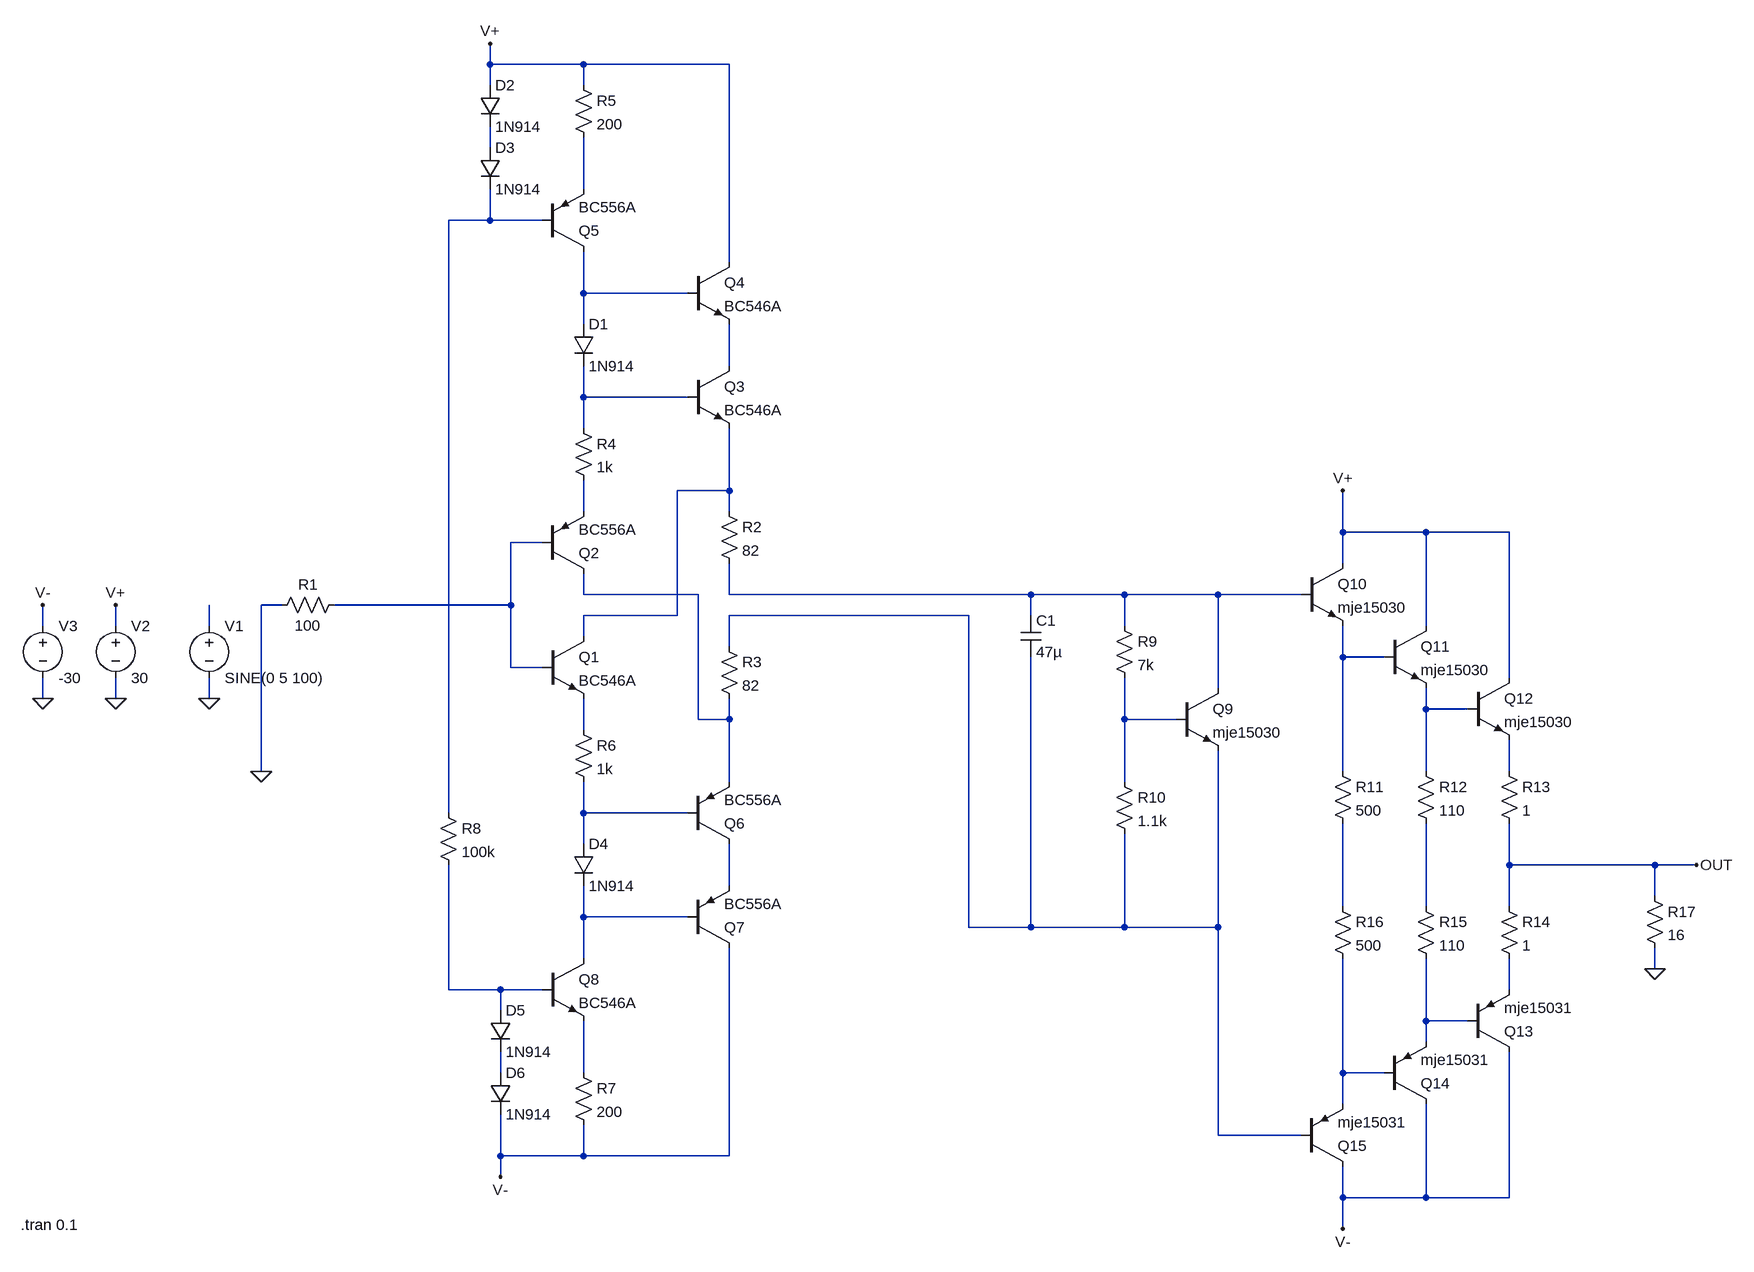
[diagram p0: schematic CFA3.asc]
CFA3.asc, the LTspice schematic file:
Version 4
SHEET 1 2036 1176
WIRE 112 -720 112 -752
WIRE 256 -720 112 -720
WIRE 480 -720 256 -720
WIRE 112 -688 112 -720
WIRE 256 -688 256 -720
WIRE 112 -592 112 -624
WIRE 256 -528 256 -608
WIRE 112 -480 112 -528
WIRE 112 -480 48 -480
WIRE 192 -480 112 -480
WIRE 480 -416 480 -720
WIRE 256 -368 256 -432
WIRE 416 -368 256 -368
WIRE 256 -320 256 -368
WIRE 480 -256 480 -320
WIRE 256 -208 256 -256
WIRE 416 -208 256 -208
WIRE 256 -160 256 -208
WIRE 480 -64 480 -160
WIRE 480 -64 400 -64
WIRE 256 -32 256 -80
WIRE 480 -32 480 -64
WIRE 1424 0 1424 -64
WIRE 1552 0 1424 0
WIRE 1680 0 1552 0
WIRE 192 16 144 16
WIRE 1424 48 1424 0
WIRE 256 96 256 64
WIRE 432 96 256 96
WIRE 480 96 480 48
WIRE 944 96 480 96
WIRE 1088 96 944 96
WIRE 1232 96 1088 96
WIRE 1360 96 1232 96
WIRE -208 112 -240 112
WIRE 144 112 144 16
WIRE 144 112 -128 112
WIRE 400 128 400 -64
WIRE 400 128 256 128
WIRE 848 128 480 128
WIRE 944 128 944 96
WIRE -576 144 -576 112
WIRE -464 144 -464 112
WIRE -320 144 -320 112
WIRE 1088 144 1088 96
WIRE 1552 144 1552 0
WIRE 256 160 256 128
WIRE 480 176 480 128
WIRE 1424 192 1424 144
WIRE 1488 192 1424 192
WIRE 144 208 144 112
WIRE 192 208 144 208
WIRE 1680 224 1680 0
WIRE 1232 240 1232 96
WIRE -576 256 -576 224
WIRE -464 256 -464 224
WIRE -320 256 -320 224
WIRE 1552 272 1552 240
WIRE 1616 272 1552 272
WIRE 432 288 432 96
WIRE 480 288 480 256
WIRE 480 288 432 288
WIRE 1088 288 1088 224
WIRE 1168 288 1088 288
WIRE 256 304 256 256
WIRE -240 368 -240 112
WIRE 1424 368 1424 192
WIRE 1552 368 1552 272
WIRE 1680 368 1680 320
WIRE 480 384 480 288
WIRE 1088 384 1088 288
WIRE 48 432 48 -480
WIRE 256 432 256 384
WIRE 416 432 256 432
WIRE 256 480 256 432
WIRE 1680 512 1680 448
WIRE 1904 512 1680 512
WIRE 1968 512 1904 512
WIRE 480 544 480 480
WIRE 1904 560 1904 512
WIRE 1424 576 1424 448
WIRE 1552 576 1552 448
WIRE 1680 576 1680 512
WIRE 256 592 256 544
WIRE 416 592 256 592
WIRE 848 608 848 128
WIRE 944 608 944 192
WIRE 944 608 848 608
WIRE 1088 608 1088 464
WIRE 1088 608 944 608
WIRE 1232 608 1232 336
WIRE 1232 608 1088 608
WIRE 256 656 256 592
WIRE 1904 672 1904 640
WIRE 48 704 48 512
WIRE 128 704 48 704
WIRE 192 704 128 704
WIRE 1680 704 1680 656
WIRE 128 736 128 704
WIRE 1552 752 1552 656
WIRE 1616 752 1552 752
WIRE 1552 784 1552 752
WIRE 128 832 128 800
WIRE 256 832 256 752
WIRE 1424 832 1424 656
WIRE 1488 832 1424 832
WIRE 1424 880 1424 832
WIRE 1232 928 1232 608
WIRE 1360 928 1232 928
WIRE 128 960 128 896
WIRE 256 960 256 912
WIRE 256 960 128 960
WIRE 480 960 480 640
WIRE 480 960 256 960
WIRE 128 992 128 960
WIRE 1424 1024 1424 976
WIRE 1552 1024 1552 880
WIRE 1552 1024 1424 1024
WIRE 1680 1024 1680 800
WIRE 1680 1024 1552 1024
WIRE 1424 1072 1424 1024
FLAG -320 256 0
FLAG 128 992 V-
FLAG 112 -752 V+
FLAG -464 256 0
FLAG -576 256 0
FLAG -464 112 V+
FLAG -576 112 V-
FLAG 1424 -64 V+
FLAG 1424 1072 V-
FLAG 1904 672 0
FLAG 1968 512 OUT
FLAG -240 368 0
SYMBOL npn 192 160 R0
SYMATTR InstName Q1
SYMATTR Value BC546A
SYMBOL pnp 192 64 M180
SYMATTR InstName Q2
SYMATTR Value BC556A
SYMBOL res -112 96 R90
WINDOW 0 0 56 VBottom 2
WINDOW 3 32 56 VTop 2
SYMATTR InstName R1
SYMATTR Value 100
SYMBOL voltage -320 128 R0
WINDOW 123 0 0 Left 0
WINDOW 39 0 0 Left 0
SYMATTR InstName V1
SYMATTR Value SINE(0 5 100)
SYMBOL res 464 -48 R0
SYMATTR InstName R2
SYMATTR Value 82
SYMBOL res 464 160 R0
SYMATTR InstName R3
SYMATTR Value 82
SYMBOL npn 416 -256 R0
SYMATTR InstName Q3
SYMATTR Value BC546A
SYMBOL res 240 -176 R0
SYMATTR InstName R4
SYMATTR Value 1k
SYMBOL diode 240 -320 R0
SYMATTR InstName D1
SYMATTR Value 1N914
SYMBOL npn 416 -416 R0
SYMATTR InstName Q4
SYMATTR Value BC546A
SYMBOL pnp 192 -432 M180
SYMATTR InstName Q5
SYMATTR Value BC556A
SYMBOL res 240 -704 R0
SYMATTR InstName R5
SYMATTR Value 200
SYMBOL diode 96 -688 R0
SYMATTR InstName D2
SYMATTR Value 1N914
SYMBOL diode 96 -592 R0
SYMATTR InstName D3
SYMATTR Value 1N914
SYMBOL pnp 416 480 M180
SYMATTR InstName Q6
SYMATTR Value BC556A
SYMBOL res 240 288 R0
SYMATTR InstName R6
SYMATTR Value 1k
SYMBOL diode 240 480 R0
SYMATTR InstName D4
SYMATTR Value 1N914
SYMBOL pnp 416 640 M180
SYMATTR InstName Q7
SYMATTR Value BC556A
SYMBOL npn 192 656 R0
SYMATTR InstName Q8
SYMATTR Value BC546A
SYMBOL res 240 816 R0
SYMATTR InstName R7
SYMATTR Value 200
SYMBOL res 32 416 R0
SYMATTR InstName R8
SYMATTR Value 100k
SYMBOL diode 112 736 R0
SYMATTR InstName D5
SYMATTR Value 1N914
SYMBOL diode 112 832 R0
SYMATTR InstName D6
SYMATTR Value 1N914
SYMBOL voltage -464 128 R0
WINDOW 123 0 0 Left 0
WINDOW 39 0 0 Left 0
SYMATTR InstName V2
SYMATTR Value 30
SYMBOL voltage -576 128 R0
WINDOW 123 0 0 Left 0
WINDOW 39 0 0 Left 0
SYMATTR InstName V3
SYMATTR Value -30
SYMBOL cap 928 128 R0
SYMATTR InstName C1
SYMATTR Value 47µ
SYMBOL res 1072 128 R0
SYMATTR InstName R9
SYMATTR Value 7k
SYMBOL npn 1168 240 R0
SYMATTR InstName Q9
SYMATTR Value mje15030
SYMBOL res 1072 368 R0
SYMATTR InstName R10
SYMATTR Value 1.1k
SYMBOL npn 1360 48 R0
SYMATTR InstName Q10
SYMATTR Value mje15030
SYMBOL npn 1488 144 R0
SYMATTR InstName Q11
SYMATTR Value mje15030
SYMBOL npn 1616 224 R0
SYMATTR InstName Q12
SYMATTR Value mje15030
SYMBOL res 1408 352 R0
SYMATTR InstName R11
SYMATTR Value 500
SYMBOL res 1536 352 R0
SYMATTR InstName R12
SYMATTR Value 110
SYMBOL res 1664 352 R0
SYMATTR InstName R13
SYMATTR Value 1
SYMBOL res 1664 560 R0
SYMATTR InstName R14
SYMATTR Value 1
SYMBOL pnp 1616 800 M180
SYMATTR InstName Q13
SYMATTR Value mje15031
SYMBOL pnp 1488 880 M180
SYMATTR InstName Q14
SYMATTR Value mje15031
SYMBOL pnp 1360 976 M180
SYMATTR InstName Q15
SYMATTR Value mje15031
SYMBOL res 1536 560 R0
SYMATTR InstName R15
SYMATTR Value 110
SYMBOL res 1408 560 R0
SYMATTR InstName R16
SYMATTR Value 500
SYMBOL res 1888 544 R0
SYMATTR InstName R17
SYMATTR Value 16
TEXT -610 1066 Left 2 !.tran 0.1

The netlist it stands for:
* CFA3.asc
Q1 N007 N009 N017 0 BC546A
Q2 N010 N009 N008 0 BC556A
R1 N009 0 100
V1 N013 0 SINE(0 5 100)
R2 N007 N011 82
R3 N012 N010 82
Q3 N005 N006 N007 0 BC546A
R4 N006 N008 1k
D1 N004 N006 1N914
Q4 V+ N004 N005 0 BC546A
Q5 N004 N003 N002 0 BC556A
R5 V+ N002 200
D2 V+ N001 1N914
D3 N001 N003 1N914
Q6 N020 N019 N010 0 BC556A
R6 N017 N019 1k
D4 N019 N023 1N914
Q7 V- N023 N020 0 BC556A
Q8 N023 N024 N028 0 BC546A
R7 N028 V- 200
R8 N003 N024 100k
D5 N024 N027 1N914
D6 N027 V- 1N914
V2 V+ 0 30
V3 V- 0 -30
C1 N011 N012 47µ
R9 N011 N016 7k
Q9 N011 N016 N012 0 mje15030
R10 N016 N012 1.1k
Q10 V+ N011 N014 0 mje15030
Q11 V+ N014 N015 0 mje15030
Q12 V+ N015 N018 0 mje15030
R11 N014 N021 500
R12 N015 N022 110
R13 N018 OUT 1
R14 OUT N025 1
Q13 V- N026 N025 0 mje15031
Q14 V- N029 N026 0 mje15031
Q15 V- N012 N029 0 mje15031
R15 N022 N026 110
R16 N021 N029 500
R17 OUT 0 16
.model D D
.lib standard.dio
.model NPN NPN
.model PNP PNP
.lib standard.bjt
.tran 0.1
.backanno
.end